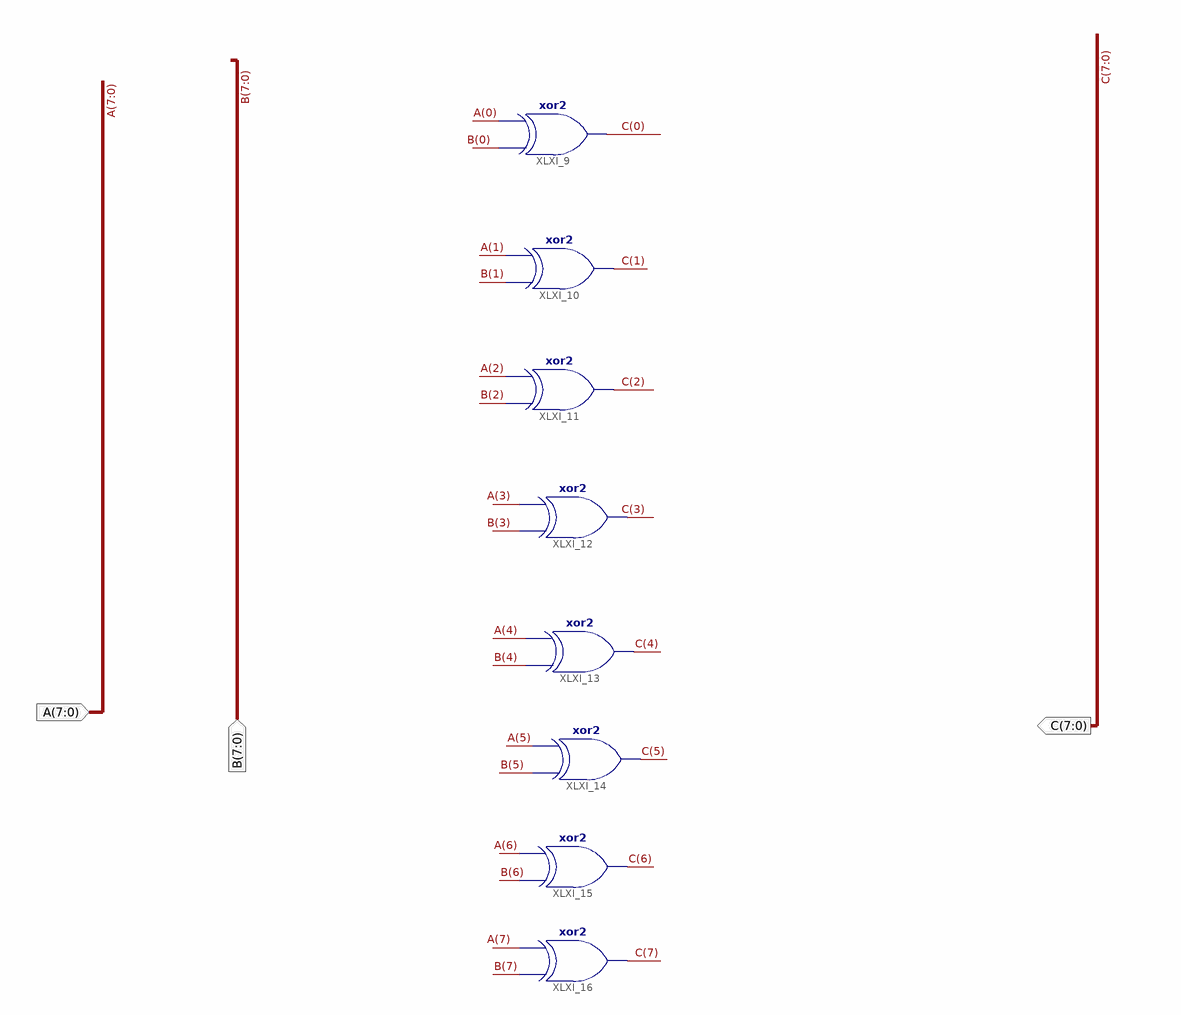
[diagram p0: schematic sheet 1]
// Xilinx ISE schematic xo2_8bits.sch (artix7) as structural Verilog: 8 symbols, 3 ports
module xo2_8bits (
  input  [7:0] A,
  input  [7:0] B,
  output [7:0] C
);

  xor XLXI_9 (C[0], B[0], A[0]);
  xor XLXI_10 (C[1], B[1], A[1]);
  xor XLXI_11 (C[2], B[2], A[2]);
  xor XLXI_12 (C[3], B[3], A[3]);
  xor XLXI_13 (C[4], B[4], A[4]);
  xor XLXI_14 (C[5], B[5], A[5]);
  xor XLXI_15 (C[6], B[6], A[6]);
  xor XLXI_16 (C[7], B[7], A[7]);
endmodule
